# Altium project ALT0062 - STM32F030 breakout.PrjPCB
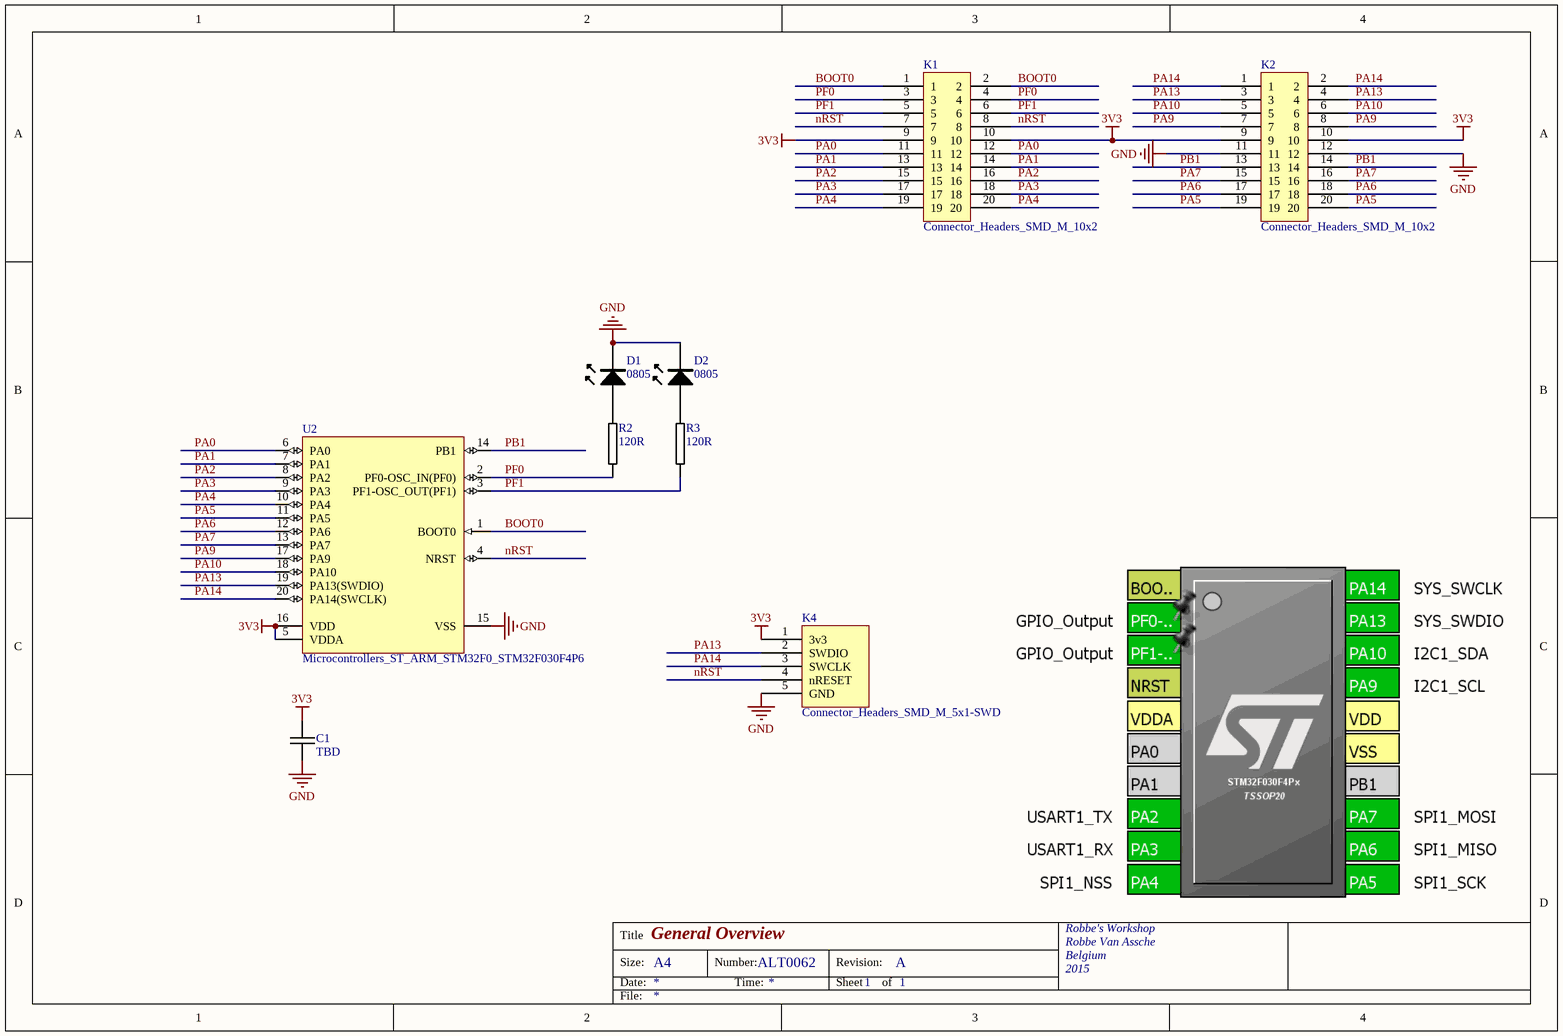
[diagram p0: General Overview.SchDoc]
1 sheet, 9 parts. Net scope: global (net labels, ports and power ports of the same name join across sheets).
Board file: PCB - 100x100 - 85x85.PcbDoc

## Sheet General Overview.SchDoc: General Overview
size A4; Organization: Robbe's Workshop; Address1: Robbe Van Assche; Address2: Belgium; Address3: 2015; DocumentNumber: ALT0062; Revision: A; SheetNumber: 1; SheetTotal: 1

### Parts
C1  TBD  [1210C-GENERIC]
D1  0805  [0805LED]
D2  0805  [0805LED]
K1  Connector_Headers_SMD_M_10x2  [Header_Male_2.54 10x2]
K2  Connector_Headers_SMD_M_10x2  [Header_Male_2.54 10x2]
K4  Connector_Headers_SMD_M_5x1-SWD  [Header_Male_2.54 5x1]
R2  120R  [0603R-120]
R3  120R  [0603R-120]
U2  Microcontrollers_ST_ARM_STM32F0_STM32F030F4P6  [STM-TSSOP20_N]

### Nets
3V3: C1.1 K1.9 K1.10 K2.9 K2.10 K4.1(3v3) U2.5(VDDA) U2.16(VDD)
GND: C1.2 D1.K D2.K K2.11 K2.12 K4.5(GND) U2.15(VSS)
BOOT0: K1.1 K1.2 U2.1(BOOT0)
nRST: K1.7 K1.8 K4.4(nRESET) U2.4(NRST)
PA0: K1.11 K1.12 U2.6(PA0)
PA1: K1.13 K1.14 U2.7(PA1)
PA2: K1.15 K1.16 U2.8(PA2)
PA3: K1.17 K1.18 U2.9(PA3)
PA4: K1.19 K1.20 U2.10(PA4)
PA5: K2.19 K2.20 U2.11(PA5)
PA6: K2.17 K2.18 U2.12(PA6)
PA7: K2.15 K2.16 U2.13(PA7)
PA9: K2.7 K2.8 U2.17(PA9)
PA10: K2.5 K2.6 U2.18(PA10)
PA13: K2.3 K2.4 K4.2(SWDIO) U2.19(PA13(SWDIO))
PA14: K2.1 K2.2 K4.3(SWCLK) U2.20(PA14(SWCLK))
PB1: K2.13 K2.14 U2.14(PB1)
PF0: K1.3 K1.4 R2.1 U2.2(PF0-OSC_IN(PF0))
PF1: K1.5 K1.6 R3.1 U2.3(PF1-OSC_OUT(PF1))
NetD1_A: D1.A R2.2
NetD2_A: D2.A R3.2

### Notes on the sheet
- Title
- Size:
- Date:
- A4
- Number:
- Time:
- Revision:
- Sheet
- of
- File:

### Library data of the parts
C1 = Passives_Capacitors_1210_1210C-TBD: CAPACITOR 1210 CERAMIC VALUE TO BE DETERMINED
D1 D2 = LED_SMD_0805
K1 K2 = Connector_Headers_SMD_M_10x2: SMD Header 10x2
K4 = Connector_Headers_SMD_M_5x1-SWD: SWD SMD Header 5x1 for STM32
R2 R3 = 0603R-120: GENERIC RESISTOR 0603; Manufacturer Part Number: RMC 1/16 120 1% R; Manufacturer: Stackpole Electronics Inc; Power (Watts): 0.1W, 1/10W; Temperature Coefficient: ±100ppm/°C; Tolerance: ±1%; Resistance In Ohms: 120; Supplier 1: Digi-Key; Supplier Part Number 1: RMC1/16120FR-ND; RoHS: RoHS non-compliant; Composition: Thick Film; Supplier: Digi-Key; Lead Style: Surface Mount (SMD - SMT); Packaging: Tape & Reel (TR); Supplier Part Number: RMC1/16120FR-ND; Case: 0603 (1608 metric); Category: Resistors
U2 = Microcontrollers_ST_ARM_STM32F0_STM32F030F4P6: ARM Cortex-M0 32-bit MCU, 16 KB Flash, 4 KB Internal RAM, 15 I/Os, 20-pin TSSOP, -40 to 85 degC, Tube; FLASH Size (Prog) (kB): 16; I/Os (High Current): 15; Internal RAM Size (kB): 4; Operating Frequency(F) (Processor speed) (MHz): 48; Supply Voltage(Vcc) min (V): 2.4; DatasheetVersion: Rev. 1; PackageVersion: Rev. 1, 11/2012; PackageReference: TSSOP20; PackageDescription: 20-Pin Thin Shrink Small Outline Package, 6.5 x 4.4 mm Body, 0.65 mm Pitch; Supplier 1: Digi-Key; Supplier Part Number 1: 497-14044-5-ND; Supplier 2: Newark; Supplier Part Number 2: 06X3648; Supplier 3: Mouser; Supplier Part Number 3: 511-STM32F030F4P6; Core: ARM Cortex-M0; Packing: Tube; Mounting Technology: Surface Mount; PartNumber: STM32F030F4P6; ComponentLink1Description: Manufacturer URL; ComponentLink1URL: http://www.st.com/web/en/home.html; ComponentLink2Description: Datasheet; ComponentLink2URL: http://www.st.com/st-web-ui/static/active/en/resource/technical/document/datasheet/DM00088500.pdf; ComponentLink3Description: Package Specification; ComponentLink3URL: http://www.st.com/st-web-ui/static/active/en/resource/technical/document/datasheet/DM00065136.pdf